# EAGLE design warm_floor (EAGLE 8.4.0)
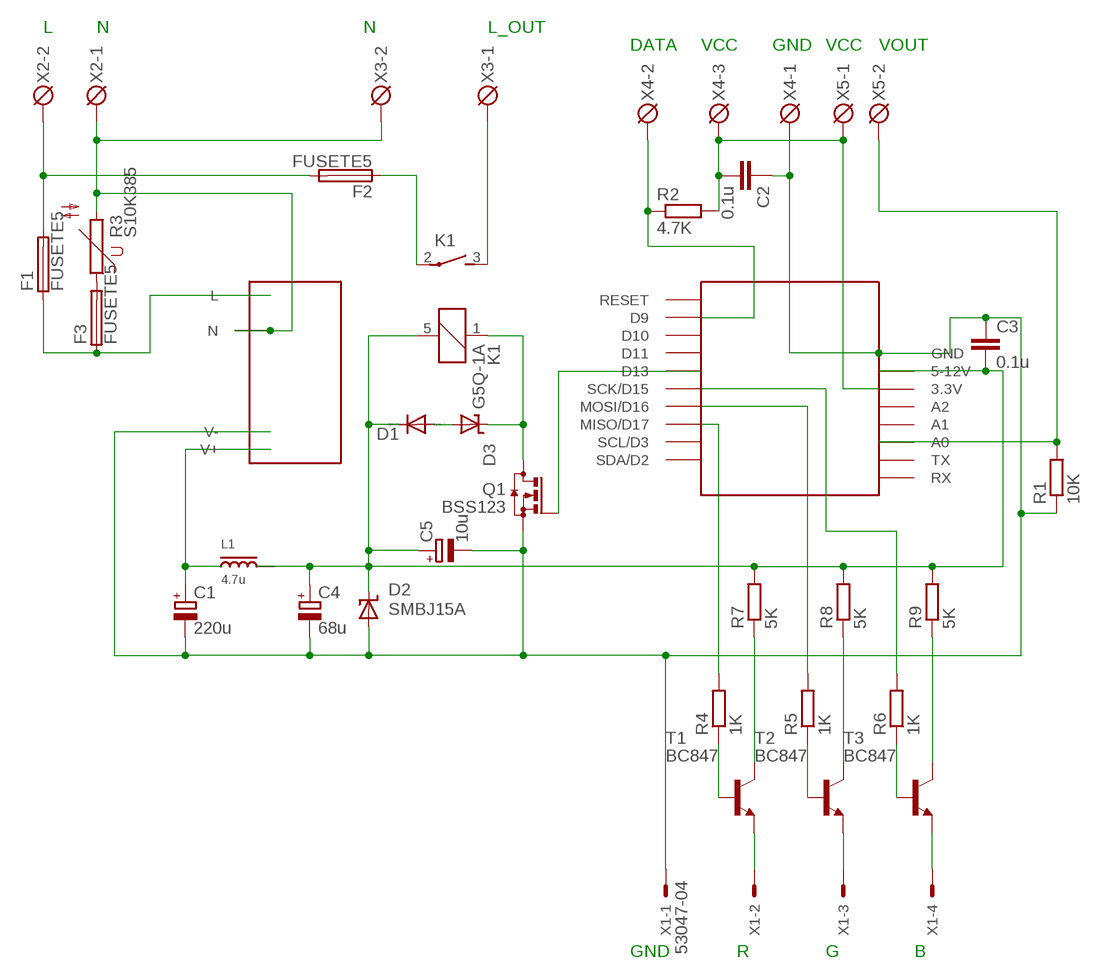
[diagram p0: schematic, sheet 1]

## Parts
C1  220u  CPOL-EUE2.5-6  [E2,5-6]
C2  0.1u  C-EUC0805  [C0805]
C3  0.1u  C-EUC0805  [C0805]
C4  68u  CPOL-EUE2.5-7  [E2,5-7]
C5  10u  CPOL-EUE2.5-6  [E2,5-6]
D1  DIODE-SOD123  [SOD123]
D2  SMBJ15A  SUPPRESSOR-SMBJ  [SMBJ]
D3  SUPPRESSOR-SMBJ  [SMBJ]
F1  FUSETE5  [TE5]
F2  FUSETE5  [TE5]
F3  FUSETE5  [TE5]
K1  G5Q-1A  [G5Q-1A]
L1  4.7u  LQH43  [LQH43]
Q1  BSS123  [SOT23]
R1  10K  R-EU_R0805  [R0805]
R2  4.7K  R-EU_R0805  [R0805]
R3  S10K385  [S10K385]
R4  1K  R-EU_R0805  [R0805]
R5  1K  R-EU_R0805  [R0805]
R6  1K  R-EU_R0805  [R0805]
R7  5K  R-EU_R0805  [R0805]
R8  5K  R-EU_R0805  [R0805]
R9  5K  R-EU_R0805  [R0805]
T1  BC847  [SOT23]
T2  BC847  [SOT23]
T3  BC847  [SOT23]
U$1  SMARTBRICK  [SMARTBRICK]
U$2  NA01/02-T2SXX  [NA01/02-T2SXX]
X1  53047-04  [53047-04]
X2  DG3XX-025.0  [DG300-5.0-02P]
X3  DG3XX-025.0  [DG300-5.0-02P]
X4  DG3XX-03-3.5  [DG350-3.5-03P]
X5  DG3XX-02-3.5  [DG350-3.5-02P]

## Nets
3.3V: C2.2 R2.2 U$1.3.3V X4.3 X5.1
DATA: R2.1 U$1.D9 X4.2
GND: C1.- C2.1 C3.1 C4.- C5.- D2.A Q1.2(S) R1.1 U$1.GND U$2.V- X1.1 X4.1
L: F1.2 F2.2 X2.2
N: R3.2 U$2.N X2.1 X3.2
N$1: C1.+ L1.P$1 U$2.V+
N$2: F3.2 R3.1
N$4: D3.C K1.1 Q1.3(D)
N$5: F2.1 K1.2(P)
N$6: K1.3(S) X3.1
N$7: D1.A D3.A
N$13: T1.2(E) X1.2
N$16: R5.2 U$1.MOSI/D16
N$17: T2.2(E) X1.3
N$18: T3.2(E) X1.4
N$19: R4.1 T1.1(B)
N$20: R5.1 T2.1(B)
N$21: R6.1 T3.1(B)
N$22: R4.2 U$1.MISO/D17
N$24: R6.2 U$1.SCK/D15
N$25: R9.1 T3.3(C)
N$26: R8.1 T2.3(C)
N$27: R7.1 T1.3(C)
NTC: R1.2 U$1.A0 X5.2
PS_L: F1.1 F3.1 U$2.L
RELAY: Q1.1(G) U$1.D13
VCC: C3.2 C4.+ C5.+ D1.C D2.C K1.5 L1.P$2 R7.2 R8.2 R9.2 U$1.VIN(5-12V)
Unconnected: U$1.A1 U$1.A2 U$1.D10 U$1.D11 U$1.RESET U$1.RX U$1.SCL/D3 U$1.SDA/D2 U$1.TX

## Notes on the sheet
- L | N | N | L_OUT
- DATA | VCC | GND | VCC | VOUT
- GND | R | G | B

## Library data of the parts
C1 C4 C5 = rcl:CPOL-EU: POLARIZED CAPACITOR, European symbol
C2 C3 = rcl:C-EU: CAPACITOR, European symbol
D1 = diode:DIODE-: DIODE
D2 D3 = diode:SUPPRESSOR-: Suppressor diode
F1-F3 = fuse:FUSE: Fuse; OC_FARNELL: unknown; OC_NEWARK: unknown
K1 = relay:G5Q-1A
L1 = smarthome:LQH43
Q1 = transistor-small-signal:BSS123: N-CHANNEL MOS FET
R1 R2 = rcl:R-EU_: RESISTOR, European symbol
R3 = varistor:S10K385: VARISTOR
R4-R9 = resistor:R-EU_: RESISTOR, European symbol
T1-T3 = transistor:BC847: NPN TRANSISTOR
U$1 = smarthome:SMARTBRICK
U$2 = smarthome:NA01/02-T2SXX
X1 = con-molex:53?-04: CONNECTOR wire to board 1.25 mm (.049 inch) pitch header; MF: WALDOM/MOLEX; MPN: 53047-0410; OC_FARNELL: 9733060; OC_NEWARK: 38C9900
X2 X3 X5 = degson:DG3XX-02: DG350-3.5-02P DG306-5.0-02P
X4 = degson:DG3XX-03: DG350-3.5-03P DG306-5.0-03P

## Board
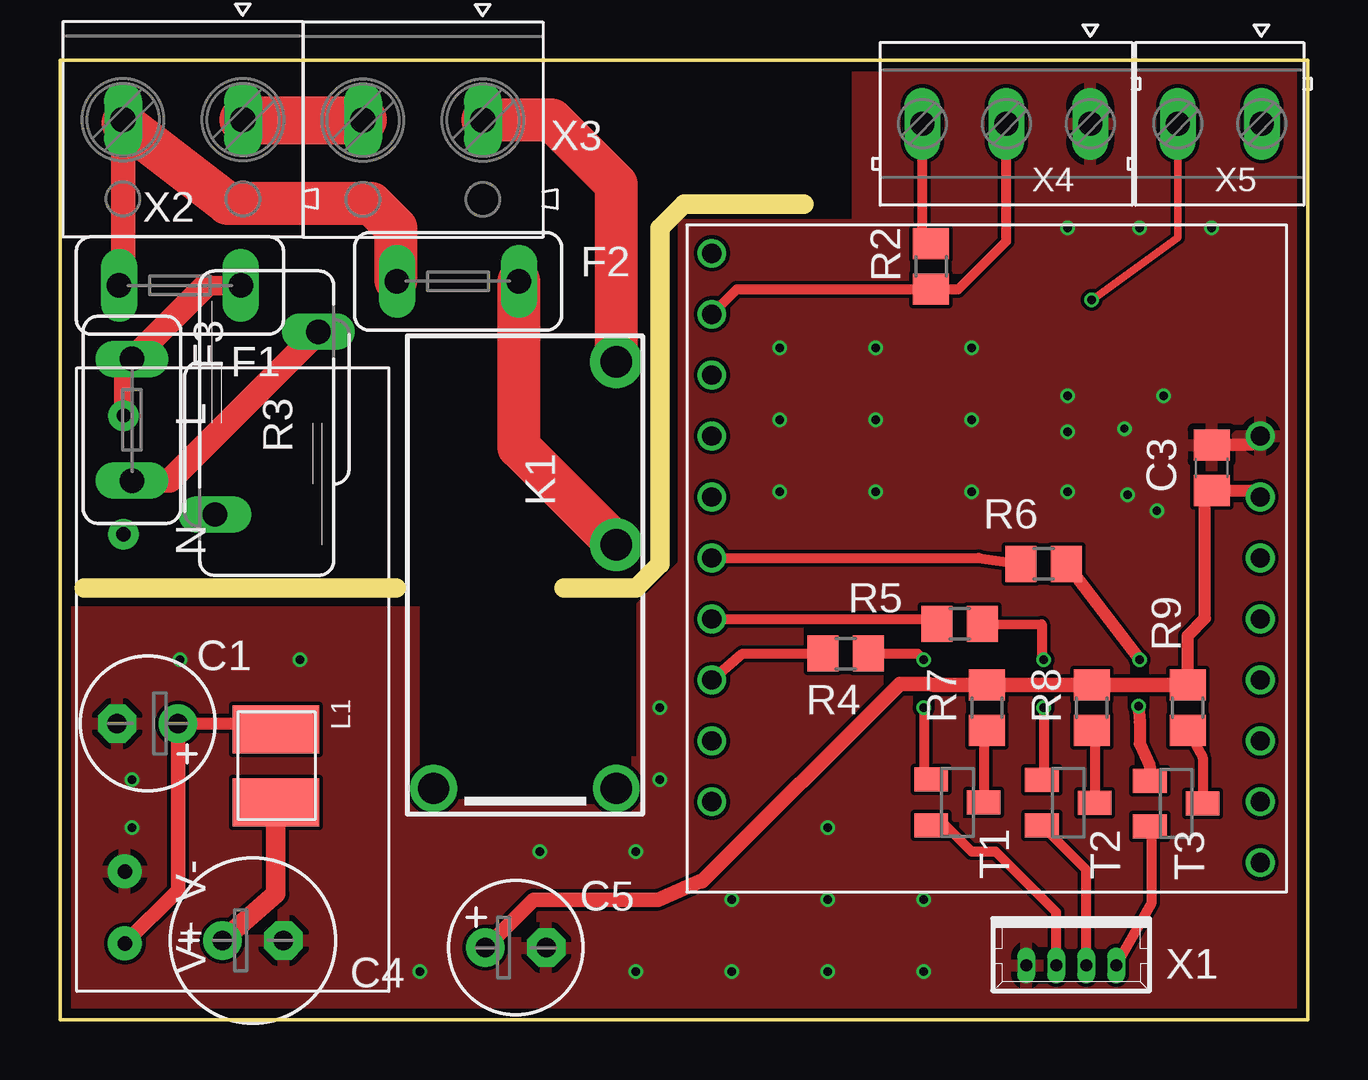
[diagram p1: board, top side]
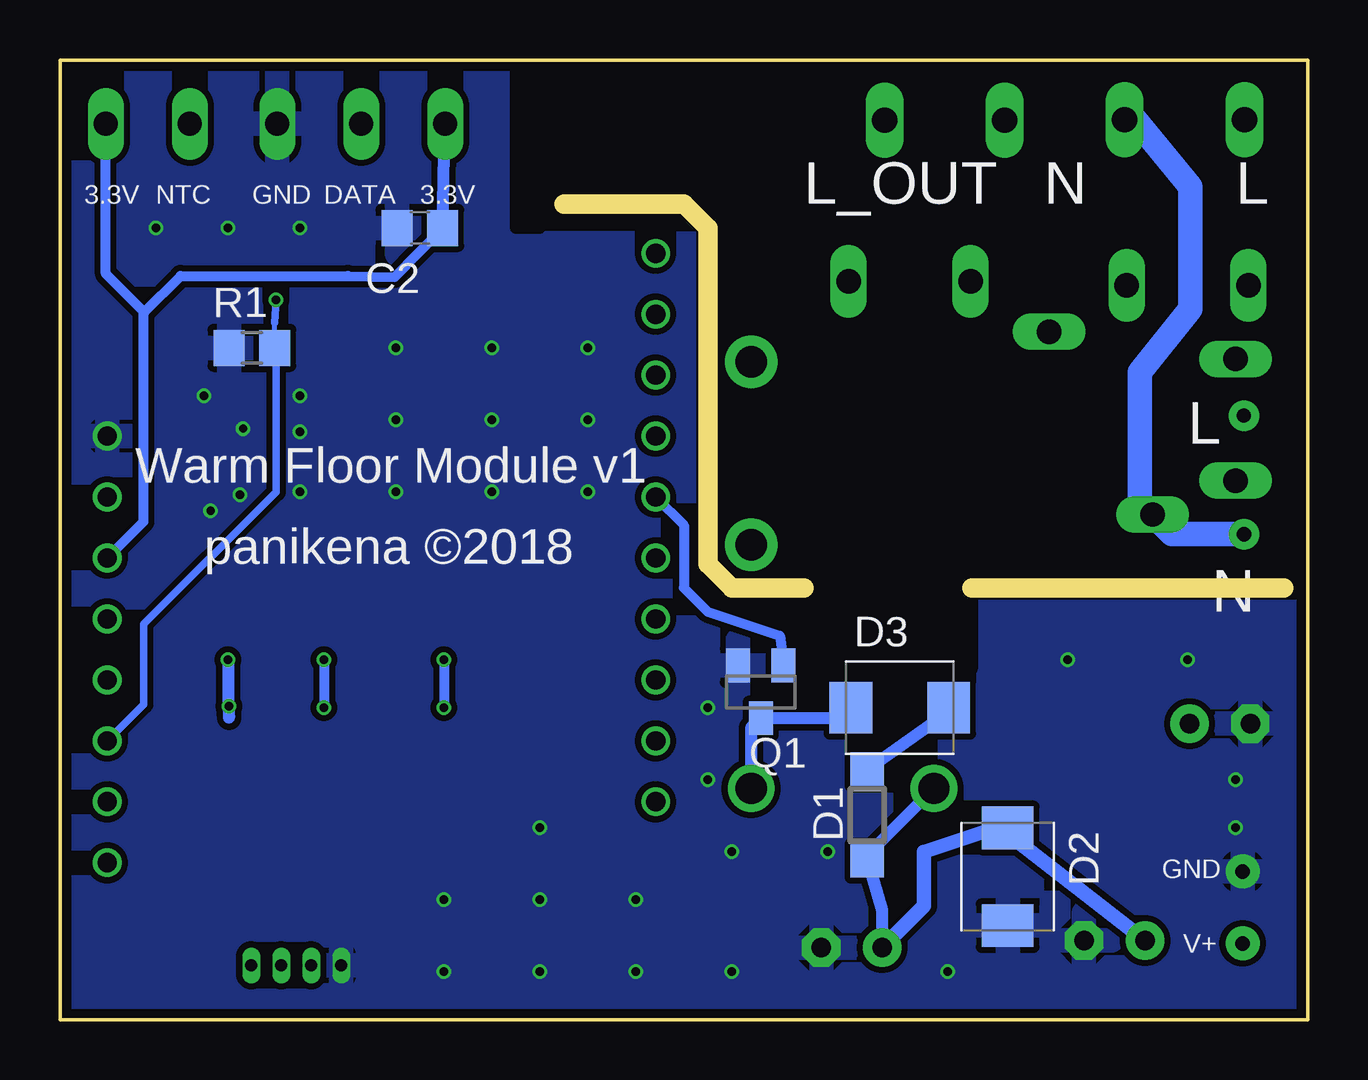
[diagram p2: board, bottom side, seen from below]

Size 52 x 40 mm. Coordinates in mm from the lower left corner, seen from the top.
Outline: 0,0 0,40 52,40 52,0 0,0
Copper layers (1*16): Top 0.035559375mm / dielectric 1.6mm / Bottom 0.035559375mm
Design rules "oshpark-2layer": minimum track width 6mil, minimum drill 10mil, track to track 6mil, track to pad 6mil, pad to pad 6mil, via to via 6mil, smd to smd 6mil, copper to edge 15mil, drill to drill 6mil, minimum pad ring 5mil, minimum via ring 5mil, stop-mask expansion 2.5mil, vias tented up to drill 0mil, thermal gap 10mil
tRestrict: area 15,11 to 24,17; area 17,9 to 22,11; area 26,33.4 to 33,39.4
bRestrict: area 32,33 to 33,39; area 26,33.1 to 32,38.1; area 14,14.6 to 20.8,18
Milling: 6 lines

### Footprints (pad centres in the part's own frame; a part is rotated, then mirrored left to right if it is on the bottom)
E2,5-6 = drill 0.813 pad 1.6: + -1.27,0 | drill 0.813 pad 1.6 octagon: - 1.27,0
C0805 = smd 1.3 x 1.5: 1 -0.95,0; 2 0.95,0
E2,5-7 = drill 0.813 pad 1.6: + -1.27,0 | drill 0.813 pad 1.6 octagon: - 1.27,0
SOD123 = smd 1.4 x 1.4: A 1.9,0; C -1.9,0
SMBJ = smd 1.78 x 2.16: A 2.04,0; C -2.03,0
TE5 = drill 1.016 long: 1 -2.54,0; 2 2.54,0
G5Q-1A = drill 1.3 pad 1.93: 1 7.62,3.81; 5 7.62,-3.81 | drill 1.3 pad 2.184: 2 -2.54,3.81; 3 -10.16,3.81
LQH43 = smd 2 x 3.6: P$1 -1.27,-0.635; P$2 1.778,-0.635
SOT23 = smd 1 x 1.4: 1 -0.95,-1.1; 2 0.95,-1.1; 3 0,1.1
R0805 = smd 1.3 x 1.5: 1 -0.95,0; 2 0.95,0
S10K385 = drill 1.016 long: 1 -2.159,-3.81; 2 2.159,3.81
SMARTBRICK = drill 0.8: 3.3V 12.7,-5.08; A0 12.7,-12.7; A1 12.7,-10.16; A2 12.7,-7.62; D9 -10.16,5.08; D10 -10.16,2.54; D11 -10.16,0; D13 -10.16,-2.54; GND 12.7,0; MISO/D17 -10.16,-10.16; MOSI/D16 -10.16,-7.62; RESET -10.16,7.62; RX 12.7,-17.78; SCK/D15 -10.16,-5.08; SCL/D3 -10.16,-12.7; SDA/D2 -10.16,-15.24; TX 12.7,-15.24; VIN 12.7,-2.54
NA01/02-T2SXX = drill 0.6 pad 1.27: L -10.89,-4.701; N -5.95,-4.71 | drill 0.6 pad 1.422: V+ 11.11,-4.65; V- 8.11,-4.65
53047-04 = drill 0.5 pad 0.698 long: 1 1.875,0.45; 2 0.625,0.45; 3 -0.625,0.45; 4 -1.875,0.45
DG300-5.0-02P = drill 1.05 long: 1 -2.5,0; 2 2.5,0
DG350-3.5-03P = drill 1 long: 1 -3.5,0; 2 0,0; 3 3.5,0
DG350-3.5-02P = drill 1 long: 1 -1.75,0; 2 1.75,0

### Placement (x,y rotation side)
C1  3.65,12.34 180 top
C2  37,33 0 bottom
C3  48,23 270 top
C4  8.04,3.29 0 top
C5  19,3 0 top
D1  18.35,8.53 90 bottom
D2  12.5,5.96 270 bottom
D3  17,13 0 bottom
F1  5,30.6 180 top
F2  16.59,30.77 180 top
F3  3,25 270 top
K1  19.38,17.25 270 top
L1  9.63,10.83 270 top
Q1  22.79,13.66 180 bottom
R1  44,28 0 bottom
R2  36.31,31.4 90 top
R3  8.62,24.86 180 top
R4  32.75,15.25 180 top
R5  37.5,16.5 180 top
R6  41,19 180 top
R7  38.63,13 90 top
R8  43,13 90 top
R9  47,13 90 top
T1  37.41,9.05 270 top
T2  42.02,9.04 270 top
T3  46.52,9.01 270 top
U$1  37.33,24.32 0 top
U$2  7.36,14.29 270 top
X1  42.15,2.71 180 top
X2  5.13,37.51 180 top
X3  15.13,37.49 180 top
X4  39.45,37.34 180 top
X5  48.34,37.34 180 top

### Tracks (layer width: path | path; a pad name or v marks a point on that pad's centre or on a via)
3.3V
  Top 0.406: R2.2 35.95,32.71 X4.3
  Bottom 0.406: U$1.3.3V 48.51,20.76 48.51,29.46 48.49,29.49 | 48.49,29.49 46.98,31 40,31 38.05,30.95 C2.2 | 48.49,29.49 50.09,31.09 X5.1
  Bottom 0.508: C2.2 36,36.05 36,37 35.95,37.05 X4.3
DATA
  Top 0.406: U$1.D9 28.22,30.45 R2.1 37.45,30.45 39.45,32.45 X4.2
GND  (via drill 0.35)
  Top 0.508: U$1.GND 49.66,23.95 C3.1
  other vias: 46,26 44.49,21.87 44.37,24.64 45.72,21.21 42,26 42,24.51 42,22 3,10 3,8 10,15 30,22 34,22 38,22 34,25 30,25 30,28 34,28 38,28 38,25 42,33 45,33 48,33 5,15 36,2 32,2 28,2 32,5 36,5 32,8 20,7 24,7 15,2 24,2 28,5 25,13 25,10
  pour Bottom (isolate 0.254): 0,17 24,17 26,21 26,40 52,40 52,0 0,0
  pour Top: 0,0 0,17 24,17 26,19 26,40 52,40 52,0
L  (via drill 0.35)
  Top 0.813: 2.63,30.77 F1.2
  Top 1.016: v2.46,37.34 X2.2 2.63,30.77
  Top 1.5: X2.2 2.63,37.37 | F2.2 14,30.82
  Top 1.8: 2.63,37.37 6.97,34.03 12.97,34.03 14,33 14,30.82
N
  Top 1.5: X2.1 7.64,37.49
  Top 2: 7.64,37.49 X3.2
  Bottom 0.813: 2.72,20.17 U$2.N
  Bottom 1.016: U$2.N 5.66,20.25 R3.2 7,21.59 7,27 4.89,29.62 4.89,34.71 7.18,37.51 X2.1
N$1
  Top 0.508: C1.+ 8.76,12.34 L1.P$1
  Top 0.61: U$2.V+ 4.92,5.39 C1.+
N$2
  Top 1.016: F3.2 4.57,22.46 R3.1
N$4
  Bottom 0.508: D3.C 19.47,12.56 Q1.3 23.19,12.16 K1.1
N$5
  Top 1.8: K1.2 19.13,23.86 F2.1
N$6
  Top 1.8: K1.3 23.19,34.81 20.51,37.49 X3.1
N$7
  Bottom 0.508: D1.A 14.96,12.82 D3.A
N$13
  Top 0.406: X1.2 41.52,4.47 39,7 38,7 36.9,8.1 T1.2
N$16
  Top 0.406: U$1.MOSI/D16 36.25,16.7
  Top 0.508: 36.25,16.7 R5.2
N$17
  Top 0.406: X1.3 42.77,6.24 T2.2
N$18
  Top 0.406: X1.4 45.5,4.87 45.5,7.48 T3.2
N$19  (via drill 0.35)
  Top 0.406: R4.1 35.75,15.25 v36,15 | v36,13 36,10.31 T1.1
  Bottom 0.406: v36,15 v36,13
N$20  (via drill 0.35)
  Top 0.406: R5.1 40.92,16.48 40.92,15.07 v41,15 | v41,13 41,10.06 T2.1
  Bottom 0.406: v41,15 v41,13
N$21  (via drill 0.35)
  Top 0.508: R6.1 v45,15 | v44.96,13.06 45,12.4 45,11.5 45.42,10.57 T3.1
  Bottom 0.508: v45,15 45,13 44.96,12.58 v44.96,13.06
N$22
  Top 0.406: U$1.MISO/D17 28.46,15.25 R4.2
N$24
  Top 0.406: U$1.SCK/D15 38.29,19.24 R6.2
N$25
  Top 0.406: R9.1 47.62,10.93 T3.3
N$26
  Top 0.406: R8.1 43.12,11.93 T2.3
N$27
  Top 0.406: R7.1 38.51,11.92 T1.3
  Top 0.508: 38.51,11.92 R7.1
NTC  (via drill 0.35)
  Top 0.305: v43,30 46.59,32.59 X5.2
  Bottom 0.203: 43,27.95 R1.2 43.05,29.05
  Bottom 0.305: U$1.A0 48.51,13.14 48.51,16.49 43,22 43,27.95 | 43.05,29.05 v43,30
PS_L
  Top 0.813: F3.1 2.65,27.19 U$2.L | 6.06,30.6 F1.1
  Top 1.016: F3.1 6.06,30.6
RELAY
  Bottom 0.406: U$1.D13 26,20.61 26,18 25,17 22,16 21.84,14.84 Q1.1
VCC
  Top 0.508: R9.2 47,16 47.72,16.72 47.72,21.77 C3.2 49.76,22.05 U$1.VIN
  Top 0.61: C5.+ 19.73,5 24.93,5 26.69,5.76 26.76,5.76 35,14 36.16,14 36.42,13.94 36.44,13.95 R7.2 R8.2 R9.2
  Top 0.813: C4.+ 8.99,5.24 L1.P$2
  Bottom 0.508: 18,3 C5.+ 17.73,4.55 D1.C 18.35,6.86 K1.5 | 13,8 12.74,7.74 12.5,7.74
  Bottom 0.61: 12.5,7.74 C4.+ | C5.+ 16,4.73 16,7 13,8
  Bottom 0.813: 12.5,7.74 D2.C

### Text on the board
bNames: L | N | L_OUT | 3.3V | DATA | GND | NTC | 3.3V | L | Warm Floor Module v1 | panikena ©2018 | N | GND | V+